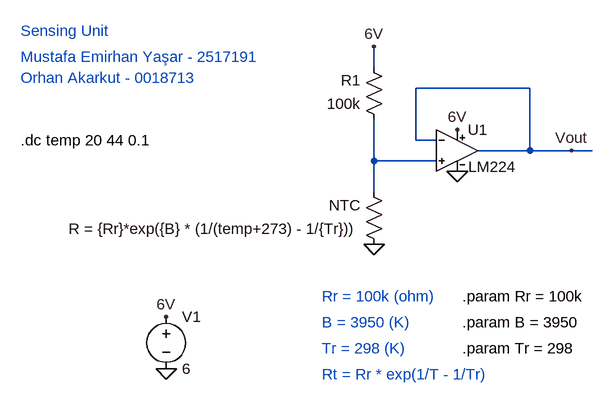
[diagram p0: schematic Unit_Sensing.asc]
Unit_Sensing.asc, the LTspice schematic file:
Version 4
SHEET 1 880 680
WIRE 64 16 64 -16
WIRE 304 48 128 48
WIRE 128 128 128 48
WIRE 160 128 128 128
WIRE 304 144 304 48
WIRE 304 144 224 144
WIRE 368 144 304 144
WIRE 400 144 368 144
WIRE 64 160 64 96
WIRE 160 160 64 160
WIRE 64 208 64 160
FLAG -256 480 0
FLAG -256 400 6V
FLAG 64 -16 6V
FLAG 64 288 0
FLAG 368 144 Vout
FLAG 192 112 6V
FLAG 192 176 0
SYMBOL OpAmps\\LM224 192 80 R0
SYMATTR InstName U1
SYMBOL res 80 112 R180
WINDOW 0 36 76 Left 2
WINDOW 3 36 40 Left 2
SYMATTR InstName R1
SYMATTR Value 100k
SYMBOL res 80 304 R180
WINDOW 0 36 76 Left 2
WINDOW 3 36 40 Left 2
SYMATTR InstName NTC
SYMATTR Value R = {Rr}*exp({B} * (1/(temp+273) - 1/{Tr}))
SYMBOL voltage -256 384 R0
WINDOW 123 0 0 Left 0
WINDOW 39 0 0 Left 0
SYMATTR InstName V1
SYMATTR Value 6
TEXT -480 -40 Left 2 ;Sensing Unit
TEXT -480 0 Left 2 ;Mustafa Emirhan Yaşar - 2517191
TEXT -480 32 Left 2 ;Orhan Akarkut - 0018713
TEXT -16 368 Left 2 ;Rr = 100k (ohm)
TEXT -16 408 Left 2 ;B = 3950 (K)
TEXT -16 448 Left 2 ;Tr = 298 (K)
TEXT 200 368 Left 2 !.param Rr = 100k
TEXT 200 408 Left 2 !.param B = 3950
TEXT 200 448 Left 2 !.param Tr = 298
TEXT -16 488 Left 2 ;Rt = Rr * exp(1/T - 1/Tr)
TEXT -480 128 Left 2 !.dc temp 20 44 0.1

The netlist it stands for:
* Unit_Sensing.asc
XU1 N001 Vout 6V 0 Vout LM224  ; pins In+ In- V+ V- OUT
R1 N001 6V 100k
R§NTC 0 N001 R = {Rr}*exp({B} * (1/(temp+273) - 1/{Tr}))
V1 6V 0 6
* Sensing Unit
* Mustafa Emirhan Yaşar - 2517191
* Orhan Akarkut - 0018713
* Rr = 100k (ohm)
* B = 3950 (K)
* Tr = 298 (K)
.param Rr = 100k
.param B = 3950
.param Tr = 298
* Rt = Rr * exp(1/T - 1/Tr)
.dc temp 20 44 0.1
.lib LM224.lib
.backanno
.end